# EAGLE schematic PulseFit (EAGLE 7.3.0)
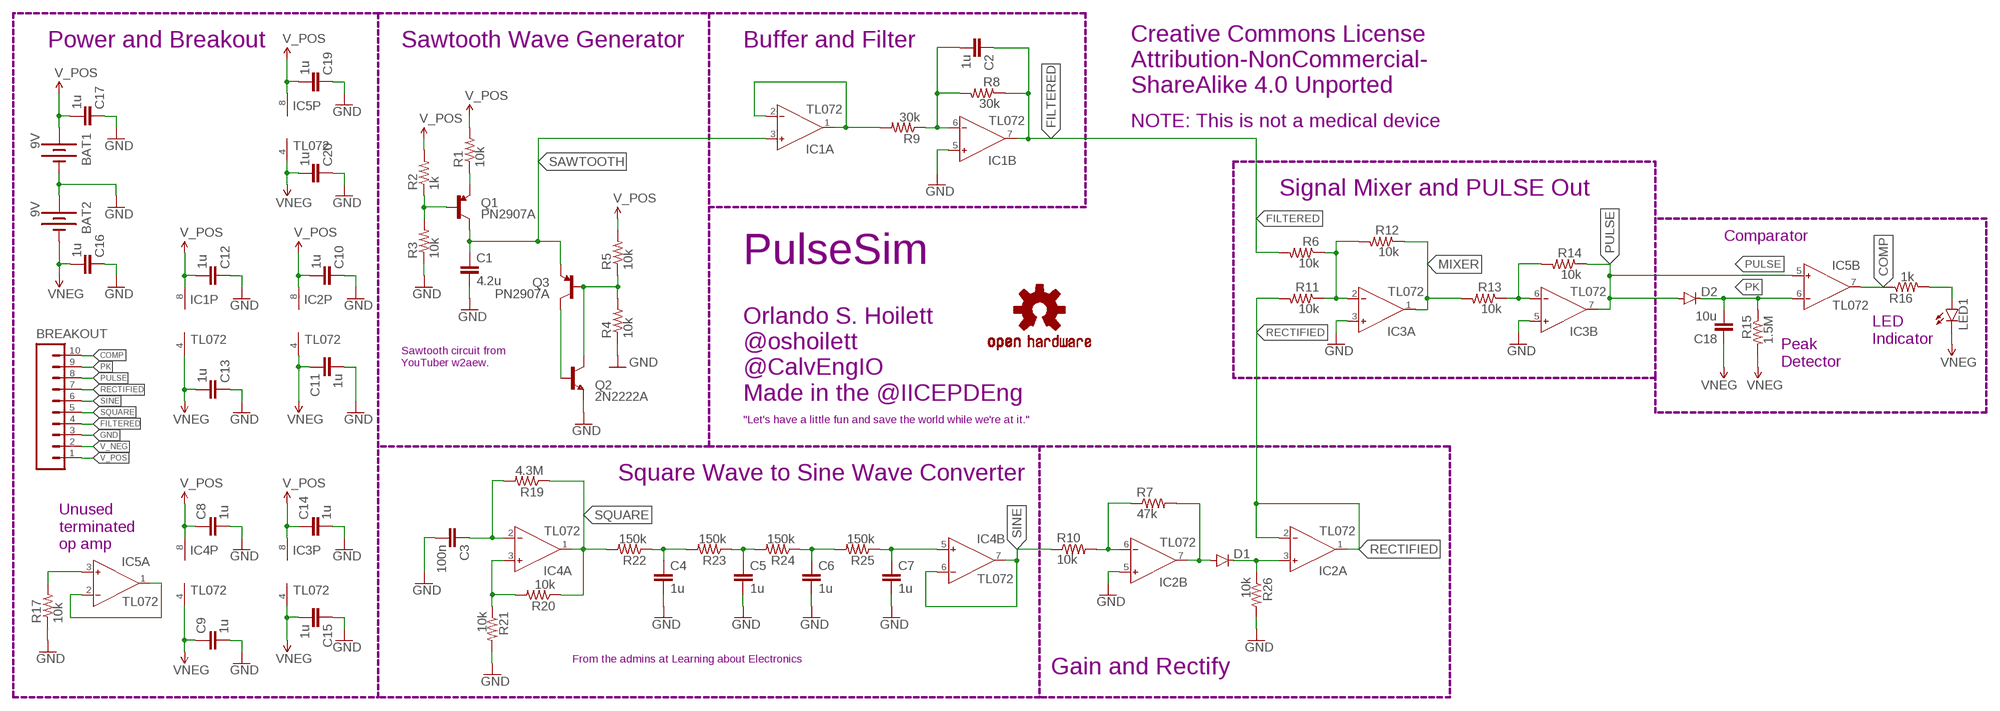
[diagram p0: schematic, sheet 1]

## Parts
BAT1  9V  BATTERY9V  [BATTCON_9V]
BAT2  9V  BATTERY9V  [BATTCON_9V]
BREAKOUT  M10NO_SILK_PTH_FEMALE  [1X10_NO_SILK]
C1  4.2u  C-EUC0402  [C0402]
C2  1u  C-EUC0402  [C0402]
C3  100n  C-EUC0402  [C0402]
C4  1u  C-EUC0402  [C0402]
C5  1u  C-EUC0402  [C0402]
C6  1u  C-EUC0402  [C0402]
C7  1u  C-EUC0402  [C0402]
C8  1u  C-EUC0402  [C0402]
C9  1u  C-EUC0402  [C0402]
C10  1u  C-EUC0402  [C0402]
C11  1u  C-EUC0402  [C0402]
C12  1u  C-EUC0402  [C0402]
C13  1u  C-EUC0402  [C0402]
C14  1u  C-EUC0402  [C0402]
C15  1u  C-EUC0402  [C0402]
C16  1u  C-EUC0402  [C0402]
C17  1u  C-EUC0402  [C0402]
C18  10u  C-EUC0402  [C0402]
C19  1u  C-EUC0402  [C0402]
C20  1u  C-EUC0402  [C0402]
D1  250mA/100V  DIODEBAS16  [SOD-323]
D2  250mA/100V  DIODEBAS16  [SOD-323]
IC1  TL072  AD8607R  [SO8]
IC2  TL072  AD8607R  [SO8]
IC3  TL072  AD8607R  [SO8]
IC4  TL072  AD8607R  [SO8]
IC5  TL072  AD8607R  [SO8]
LED1  LED1206-BOTTOM  [LED-1206-BOTTOM]
LOGO1  OSHW-LOGOS  [OSHW-LOGO-S]
Q1  PN2907A  TRANSISTOR_PNPMMBT4403  [SOT23-3]
Q2  2N2222A  TRANSISTOR_NPNMMBT5088  [SOT23-3]
Q3  PN2907A  TRANSISTOR_PNPMMBT4403  [SOT23-3]
R1  10k  R-US_R0402  [R0402]
R2  1k  R-US_R0402  [R0402]
R3  10k  R-US_R0402  [R0402]
R4  10k  R-US_R0402  [R0402]
R5  10k  R-US_R0402  [R0402]
R6  10k  R-US_R0402  [R0402]
R7  47k  R-US_R0402  [R0402]
R8  30k  R-US_R0402  [R0402]
R9  30k  R-US_R0402  [R0402]
R10  10k  R-US_R0402  [R0402]
R11  10k  R-US_R0402  [R0402]
R12  10k  R-US_R0402  [R0402]
R13  10k  R-US_R0402  [R0402]
R14  10k  R-US_R0402  [R0402]
R15  1.5M  R-US_R0402  [R0402]
R16  1k  R-US_R0402  [R0402]
R17  10k  R-US_R0402  [R0402]
R19  4.3M  R-US_R0402  [R0402]
R20  10k  R-US_R0402  [R0402]
R21  10k  R-US_R0402  [R0402]
R22  150k  R-US_R0402  [R0402]
R23  150k  R-US_R0402  [R0402]
R24  150k  R-US_R0402  [R0402]
R25  150k  R-US_R0402  [R0402]
R26  10k  R-US_R0402  [R0402]

## Nets
COMP: BREAKOUT.10 IC5.7(B:OUT) R16.1
FILTERED: BREAKOUT.4 C2.1 IC1.7(B:OUT) R6.2 R8.1
GND: BAT1.- BAT2.+ BREAKOUT.3 C1.2 C3.2 C4.2 C5.2 C6.2 C7.2 C8.2 C9.2 C10.1 C11.2 C12.1 C13.1 C14.2 C15.1 C16.1 C17.1 C19.1 C20.1 IC1.5(B:IN+) IC2.5(B:IN+) IC3.3(A:IN+) IC3.5(B:IN+) Q2.2(E) R3.1 R4.1 R17.1 R21.2 R26.2
MIXER: IC3.1(A:OUT) R12.1 R13.2
N$1: Q1.2(E) R1.1
N$2: IC3.6(B:IN-) R13.1 R14.2
N$3: Q1.1(B) R2.1 R3.2
N$4: Q2.3(C) Q3.1(B) R4.2 R5.1
N$5: Q2.1(B) Q3.3(C)
N$6: IC1.1(A:OUT) IC1.2(A:IN-) R9.2
N$8: IC3.2(A:IN-) R6.1 R11.1 R12.2
N$10: LED1.A R16.2
N$11: C2.2 IC1.6(B:IN-) R8.2 R9.1
N$12: IC5.1(A:OUT) IC5.2(A:IN-)
N$13: IC5.3(A:IN+) R17.2
N$17: C3.1 IC4.2(A:IN-) R19.2
N$18: IC4.3(A:IN+) R20.2 R21.1
N$19: C6.1 R24.1 R25.2
N$20: C4.1 R22.1 R23.2
N$21: C7.1 IC4.5(B:IN+) R25.1
N$22: C5.1 R23.1 R24.2
N$24: D1.C IC2.3(A:IN+) R26.1
N$25: IC2.6(B:IN-) R7.1 R10.2
N$27: D1.A IC2.7(B:OUT) R7.2
PK: BREAKOUT.9 C18.2 D2.C IC5.6(B:IN-) R15.1
PULSE: BREAKOUT.8 D2.A IC3.7(B:OUT) IC5.5(B:IN+) R14.1
RECTIFIED: BREAKOUT.7 IC2.1(A:OUT) IC2.2(A:IN-) R11.2
SAWTOOTH: C1.1 IC1.3(A:IN+) Q1.3(C) Q3.2(E)
SINE: BREAKOUT.6 IC4.6(B:IN-) IC4.7(B:OUT) R10.1
SQUARE: BREAKOUT.5 IC4.1(A:OUT) R19.1 R20.1 R22.2
V_BATT: BAT1.+ C8.1 C12.2 C14.1 C17.2 C19.2 IC1.8(P:V+) IC3.8(P:V+) IC4.8(P:V+) IC5.8(P:V+) ; supply symbol labelled V_POS
V_NEG: BREAKOUT.2 C9.1 C11.1 C13.2 C15.2 IC1.4(P:V-) IC2.4(P:V-) IC3.4(P:V-) IC4.4(P:V-) ; supply symbol labelled VNEG
V_POS: BREAKOUT.1 C10.2 IC2.8(P:V+) R1.2 R2.2 R5.2
VNEG: BAT2.- C16.2 C18.1 C20.2 IC5.4(P:V-) LED1.C R15.2

## Notes on the sheet
- Power and Breakout | Sawtooth Wave Generator | Buffer and Filter
- Creative Commons License
  Attribution-NonCommercial-
  ShareAlike 4.0 Unported
- NOTE: This is not a medical device
- Signal Mixer and PULSE Out
- Comparator
- PulseSim
- LED
  Indicator
- Sawtooth circuit from
  YouTuber w2aew.
- Peak
  Detector
- Orlando S. Hoilett
  @oshoilett
  @CalvEngIO
  Made in the @IICEPDEng
- "Let's have a little fun and save the world while we're at it."
- Square Wave to Sine Wave Converter
- Unused
  terminated
  op amp
- From the admins at Learning about Electronics
- Gain and Rectify

## Library data of the parts
BAT1 BAT2 = SparkFun-Electromechanical:BATTERY: Battery Holders Various common sizes : AA, AAA, 18650 (PRT-12895), 20mm coin cell and 12mm coin cell. 20MM_4LEGS, BATT-10373
BREAKOUT = SparkFun-Connectors:M10: Header 10 Standard 10-pin 0.1" header. Use with straight break away headers (SKU : PRT-00116), right angle break away headers (PRT-00553), swiss pins (PRT-00743), machine pins (PRT-00117), and female headers (PRT-00115).; PROD_ID: CONN-11563
C1-C20 = resistor:C-EU: CAPACITOR, European symbol
D1 D2 = SparkFun-DiscreteSemi:DIODE: Diode These are standard reverse protection diodes and small signal diodes. SMA package can handle up to about 1A. SOD-323 can handle about 200mA. What the SOD-323 package when ordering, there are some mfgs out there that are 5-pin packages.; PROD_ID: DIO-09646
IC1-IC5 = analog-devices:AD8607: Precision Micropower, Low Noise CMOS, Rail-to-Rail Input/Output Operational Amplifiers Source: http://www.analog.com/static/imported-files/data_sheets/AD8603_8607_8609.pdf; MPN: AD8607ARMZ-R2; OC_FARNELL: 1651293; OC_NEWARK: 19M8927
LED1 = SparkFun-LED:LED: LEDs Standard schematic elements and footprints for 5mm, 3mm, 1206, and 0603 sized LEDs. 5mm - Spark Fun Electronics SKU : COM-00529 (and others)
LOGO1 = SparkFun-Aesthetics:OSHW-LOGO: Open Source Hardware Logo This logo indicates the piece of hardware it is found on incorporates a OSHW license and/or adheres to the definition of open source hardware found here: http://freedomdefined.org/OSHW
Q1 Q3 = SparkFun-DiscreteSemi:TRANSISTOR_PNP: Generic PNP BJT Double check pinouts against datasheets- not all devices are the same! MMBT3906 - 40V 200mA SOT-23 (TRANS-08052) MMBT4403 - 40V 600mA SOT-23 (TRANS-09245); PROD_ID: TRANS-09245; VALUE: MMBT4403
Q2 = SparkFun-DiscreteSemi:TRANSISTOR_NPN: Generic NPN BJT MMBT2222A - TRANS-08049 (SOT-23, 1A 40V) MPSA42 - TRANS-09116 (SOT-23, 500mA 300V) MMBT5088LT1G - TRANS-11160 (SOT-23, 50 mA 30V) BC547 - COM-08928 <http://www.sparkfun.com/products/8928> (TO-92 45V 100mA) (1.Collector 2.Base 3.Emitter) 2N3904 - COM-00521 <http://www.sparkfun.com/products/521> (TO-92 40V 200mA) (1.Emitter 2.Base 3.Collector) P2N2222A - COM-12852 <http://www.sparkfun.com/products/12852> (TO-92 40V 600mA) (1.Collector 2.Base 3.Emitter); PROD_ID: TRANS-11160; VALUE: MMBT5088
R1-R17 R19-R26 = resistor:R-US_: RESISTOR, American symbol